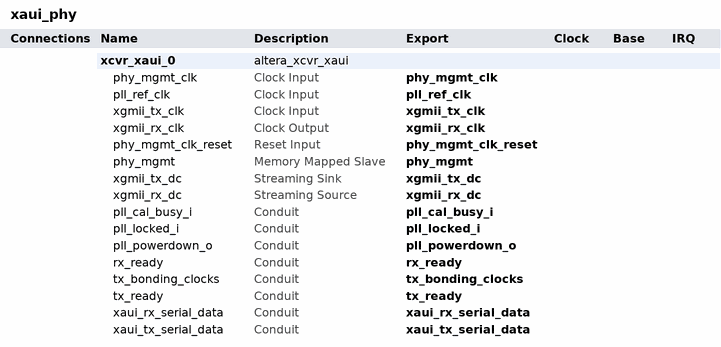
[diagram p0: system contents]
# Platform Designer (Qsys) system xaui_phy, Arria 10 10AX115R4F40I3SG
# Parameters at their usual value, and those the tool derives, are not listed.
package require -exact qsys 14.1
create_system xaui_phy
set_project_property DEVICE_FAMILY {Arria 10}
set_project_property DEVICE 10AX115R4F40I3SG

add_instance xcvr_xaui_0 altera_xcvr_xaui 14.1
set_instance_property xcvr_xaui_0 AUTO_EXPORT true
set_instance_parameter_value xcvr_xaui_0 device_family {Arria 10}
set_instance_parameter_value xcvr_xaui_0 dyn_reconf 0
set_instance_parameter_value xcvr_xaui_0 en_dual_fifo 0
set_instance_parameter_value xcvr_xaui_0 en_synce_support 0
set_instance_parameter_value xcvr_xaui_0 external_pma_ctrl_reconf 0
set_instance_parameter_value xcvr_xaui_0 gui_pll_type CMU
set_instance_parameter_value xcvr_xaui_0 hard_xaui_cfg {Only Hard XAUI is supported for this device.}
set_instance_parameter_value xcvr_xaui_0 interface_type {Soft XAUI}
set_instance_parameter_value xcvr_xaui_0 mgmt_clk_in_hz 0
set_instance_parameter_value xcvr_xaui_0 number_of_interfaces 1
set_instance_parameter_value xcvr_xaui_0 part_trait_bd NIGHTFURY5
set_instance_parameter_value xcvr_xaui_0 pll_external_enable 0
set_instance_parameter_value xcvr_xaui_0 recovered_clk_out 0
set_instance_parameter_value xcvr_xaui_0 rx_common_mode 0.82v
set_instance_parameter_value xcvr_xaui_0 rx_eq_ctrl 0
set_instance_parameter_value xcvr_xaui_0 rx_eq_dc_gain 0
set_instance_parameter_value xcvr_xaui_0 rx_termination OCT_100_OHMS
set_instance_parameter_value xcvr_xaui_0 soft_xaui_cfg {Only Soft XAUI is supported for this device.}
set_instance_parameter_value xcvr_xaui_0 starting_channel_number 0
set_instance_parameter_value xcvr_xaui_0 tx_preemp_pretap 0
set_instance_parameter_value xcvr_xaui_0 tx_preemp_pretap_inv false
set_instance_parameter_value xcvr_xaui_0 tx_preemp_tap_1 0
set_instance_parameter_value xcvr_xaui_0 tx_preemp_tap_2 0
set_instance_parameter_value xcvr_xaui_0 tx_preemp_tap_2_inv false
set_instance_parameter_value xcvr_xaui_0 tx_termination OCT_100_OHMS
set_instance_parameter_value xcvr_xaui_0 tx_vod_selection 4
set_instance_parameter_value xcvr_xaui_0 use_control_and_status_ports 0
set_instance_parameter_value xcvr_xaui_0 use_rx_rate_match 0

# exported interfaces
add_interface phy_mgmt avalon slave
set_interface_property phy_mgmt EXPORT_OF xcvr_xaui_0.phy_mgmt
add_interface phy_mgmt_clk clock sink
set_interface_property phy_mgmt_clk EXPORT_OF xcvr_xaui_0.phy_mgmt_clk
add_interface phy_mgmt_clk_reset reset sink
set_interface_property phy_mgmt_clk_reset EXPORT_OF xcvr_xaui_0.phy_mgmt_clk_reset
add_interface pll_cal_busy_i conduit end
set_interface_property pll_cal_busy_i EXPORT_OF xcvr_xaui_0.pll_cal_busy_i
add_interface pll_locked_i conduit end
set_interface_property pll_locked_i EXPORT_OF xcvr_xaui_0.pll_locked_i
add_interface pll_powerdown_o conduit end
set_interface_property pll_powerdown_o EXPORT_OF xcvr_xaui_0.pll_powerdown_o
add_interface pll_ref_clk clock sink
set_interface_property pll_ref_clk EXPORT_OF xcvr_xaui_0.pll_ref_clk
add_interface rx_ready conduit end
set_interface_property rx_ready EXPORT_OF xcvr_xaui_0.rx_ready
add_interface tx_bonding_clocks conduit end
set_interface_property tx_bonding_clocks EXPORT_OF xcvr_xaui_0.tx_bonding_clocks
add_interface tx_ready conduit end
set_interface_property tx_ready EXPORT_OF xcvr_xaui_0.tx_ready
add_interface xaui_rx_serial_data conduit end
set_interface_property xaui_rx_serial_data EXPORT_OF xcvr_xaui_0.xaui_rx_serial_data
add_interface xaui_tx_serial_data conduit end
set_interface_property xaui_tx_serial_data EXPORT_OF xcvr_xaui_0.xaui_tx_serial_data
add_interface xgmii_rx_clk clock source
set_interface_property xgmii_rx_clk EXPORT_OF xcvr_xaui_0.xgmii_rx_clk
add_interface xgmii_rx_dc avalon_streaming source
set_interface_property xgmii_rx_dc EXPORT_OF xcvr_xaui_0.xgmii_rx_dc
add_interface xgmii_tx_clk clock sink
set_interface_property xgmii_tx_clk EXPORT_OF xcvr_xaui_0.xgmii_tx_clk
add_interface xgmii_tx_dc avalon_streaming sink
set_interface_property xgmii_tx_dc EXPORT_OF xcvr_xaui_0.xgmii_tx_dc

set_interconnect_requirement {$system} qsys_mm.clockCrossingAdapter HANDSHAKE
set_interconnect_requirement {$system} qsys_mm.insertDefaultSlave FALSE
set_interconnect_requirement {$system} qsys_mm.maxAdditionalLatency 1

save_system xaui_phy.qsys
